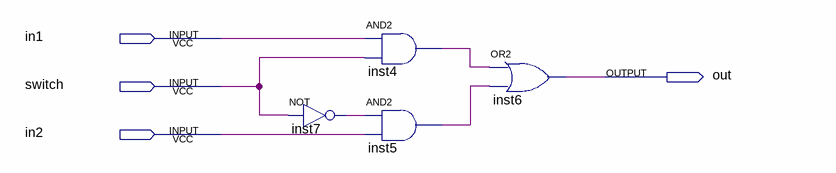
[diagram p0: schematic sheet]
// Quartus schematic Block1.bdf as structural Verilog: 4 symbols, 4 pins
module Block1 (
  input  in1,
  input  switch,
  input  in2,
  output out
);

  wire inst4_out, inst5_out, inst7_out;

  not inst7 (inst7_out, switch);
  and inst4 (inst4_out, in1, switch);
  and inst5 (inst5_out, inst7_out, in2);
  or inst6 (out, inst4_out, inst5_out);
endmodule
